# Altium schematic sheet Power Board.2.SchDoc
size A4; SheetNumber: 2; SheetTotal: 2
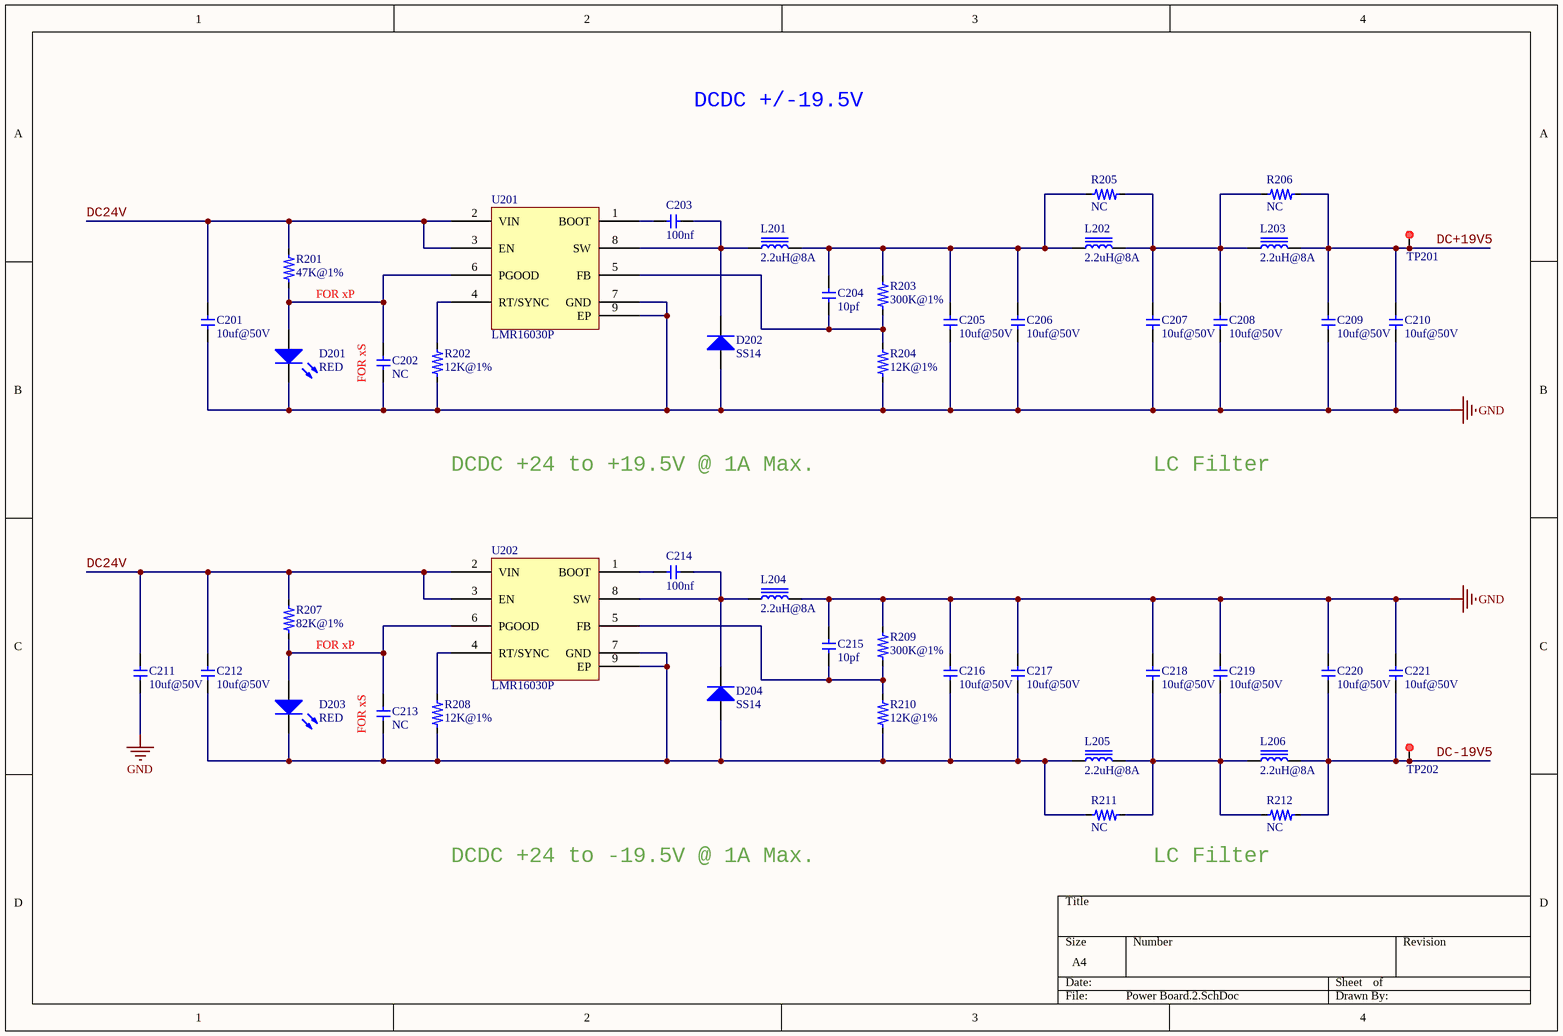
[diagram p0: Power Board.2.SchDoc]

## Parts
C201  value 10uf@50V  [C1206]  (hidden comment: Cap)
C202  value NC  [C0603]  (hidden comment: Cap)
C203  value 100nf  [C0603]  (hidden comment: Cap)
C204  value 10pf  [C0603]  (hidden comment: Cap)
C205  value 10uf@50V  [C1206]  (hidden comment: Cap)
C206  value 10uf@50V  [C1206]  (hidden comment: Cap)
C207  value 10uf@50V  [C1206]  (hidden comment: Cap)
C208  value 10uf@50V  [C1206]  (hidden comment: Cap)
C209  value 10uf@50V  [C1206]  (hidden comment: Cap)
C210  value 10uf@50V  [C1206]  (hidden comment: Cap)
C211  value 10uf@50V  [C1206]  (hidden comment: Cap)
C212  value 10uf@50V  [C1206]  (hidden comment: Cap)
C213  value NC  [C0603]  (hidden comment: Cap)
C214  value 100nf  [C0603]  (hidden comment: Cap)
C215  value 10pf  [C0603]  (hidden comment: Cap)
C216  value 10uf@50V  [C1206]  (hidden comment: Cap)
C217  value 10uf@50V  [C1206]  (hidden comment: Cap)
C218  value 10uf@50V  [C1206]  (hidden comment: Cap)
C219  value 10uf@50V  [C1206]  (hidden comment: Cap)
C220  value 10uf@50V  [C1206]  (hidden comment: Cap)
C221  value 10uf@50V  [C1206]  (hidden comment: Cap)
D201  value RED  [LED0603]  (hidden comment: LED)
D202  value SS14  [DIODE-SMAF]  (hidden comment: Diode)
D203  value RED  [LED0603]  (hidden comment: LED)
D204  value SS14  [DIODE-SMAF]  (hidden comment: Diode)
L201  value 2.2uH@8A  [L06063]  (hidden comment: Inductor Iron)
L202  value 2.2uH@8A  [L06063]  (hidden comment: Inductor Iron)
L203  value 2.2uH@8A  [L06063]  (hidden comment: Inductor Iron)
L204  value 2.2uH@8A  [L06063]  (hidden comment: Inductor Iron)
L205  value 2.2uH@8A  [L06063]  (hidden comment: Inductor Iron)
L206  value 2.2uH@8A  [L06063]  (hidden comment: Inductor Iron)
R201  value 47K@1%  [R0603]  (hidden comment: Res)
R202  value 12K@1%  [R0603]  (hidden comment: Res)
R203  value 300K@1%  [R0603]  (hidden comment: Res)
R204  value 12K@1%  [R0603]  (hidden comment: Res)
R205  value NC  [R0603]  (hidden comment: Res)
R206  value NC  [R0603]  (hidden comment: Res)
R207  value 82K@1%  [R0603]  (hidden comment: Res)
R208  value 12K@1%  [R0603]  (hidden comment: Res)
R209  value 300K@1%  [R0603]  (hidden comment: Res)
R210  value 12K@1%  [R0603]  (hidden comment: Res)
R211  value NC  [R0603]  (hidden comment: Res)
R212  value NC  [R0603]  (hidden comment: Res)
TP201  TestPoint  [TestPoint-SMD100]  (value not drawn)
TP202  TestPoint  [TestPoint-SMD100]  (value not drawn)
U201  LMR16030P  [LMR16030-SOIC8]
U202  LMR16030P  [LMR16030-SOIC8]

## Nets
GND: C201.1 C202.1 C205.1 C206.1 C207.1 C208.1 C209.1 C210.1 C211.1 C215.1 C216.2 C217.2 C218.2 C219.2 C220.2 C221.2 D201.2(K) D202.1(A) L204.2 R202.1 R204.1 R209.2 U201.7(GND) U201.9(EP)
DC24V: C201.2 C211.2 C212.2 R201.2 R207.2 U201.2(VIN) U201.3(EN) U202.2(VIN) U202.3(EN)
DC+19V5: C209.2 C210.2 L203.2 R206.1 TP201.1
DC-19V5: C220.1 C221.1 L206.2 R212.1 TP202.1
NetC202_2: C202.2 D201.1(A) R201.1 U201.6(PGOOD)
NetC203_1: C203.1 D202.2(K) L201.1 U201.8(SW)
NetC203_2: C203.2 U201.1(BOOT)
NetC204_1: C204.1 C205.2 C206.2 L201.2 L202.1 R203.2 R205.2
NetC204_2: C204.2 R203.1 R204.2 U201.5(FB)
NetC207_2: C207.2 C208.2 L202.2 L203.1 R205.1 R206.2
NetC212_1: C212.1 C213.1 C216.1 C217.1 D203.2(K) D204.1(A) L205.1 R208.1 R210.1 R211.2 U202.7(GND) U202.9(EP)
NetC213_2: C213.2 D203.1(A) R207.1 U202.6(PGOOD)
NetC214_1: C214.1 D204.2(K) L204.1 U202.8(SW)
NetC214_2: C214.2 U202.1(BOOT)
NetC215_2: C215.2 R209.1 R210.2 U202.5(FB)
NetC218_1: C218.1 C219.1 L205.2 L206.1 R211.1 R212.2
NetR202_2: R202.2 U201.4(RT/SYNC)
NetR208_2: R208.2 U202.4(RT/SYNC)

## Notes on the sheet
- DCDC +/-19.5V
- (near R201) FOR xP
- (near C202) FOR xS
- DCDC +24 to +19.5V @ 1A Max.
- LC Filter
- (near R207) FOR xP
- (near C213) FOR xS
- DCDC +24 to -19.5V @ 1A Max.

## Library data of the parts
D202 D204 = Diode: 通用二极管
L201-L206 = Inductor Iron: Magnetic-Core Inductor
R201-R212 = Res: 电阻
TP201 TP202 = TestPoint: 测试点
U201 U202 = LMR16030P: LMR16030 SIMPLE SWITCHER® 60-V, 3-A Step-Down Converter With 40-µA IQ